# EAGLE schematic keytar-knob (EAGLE 9.5.0)
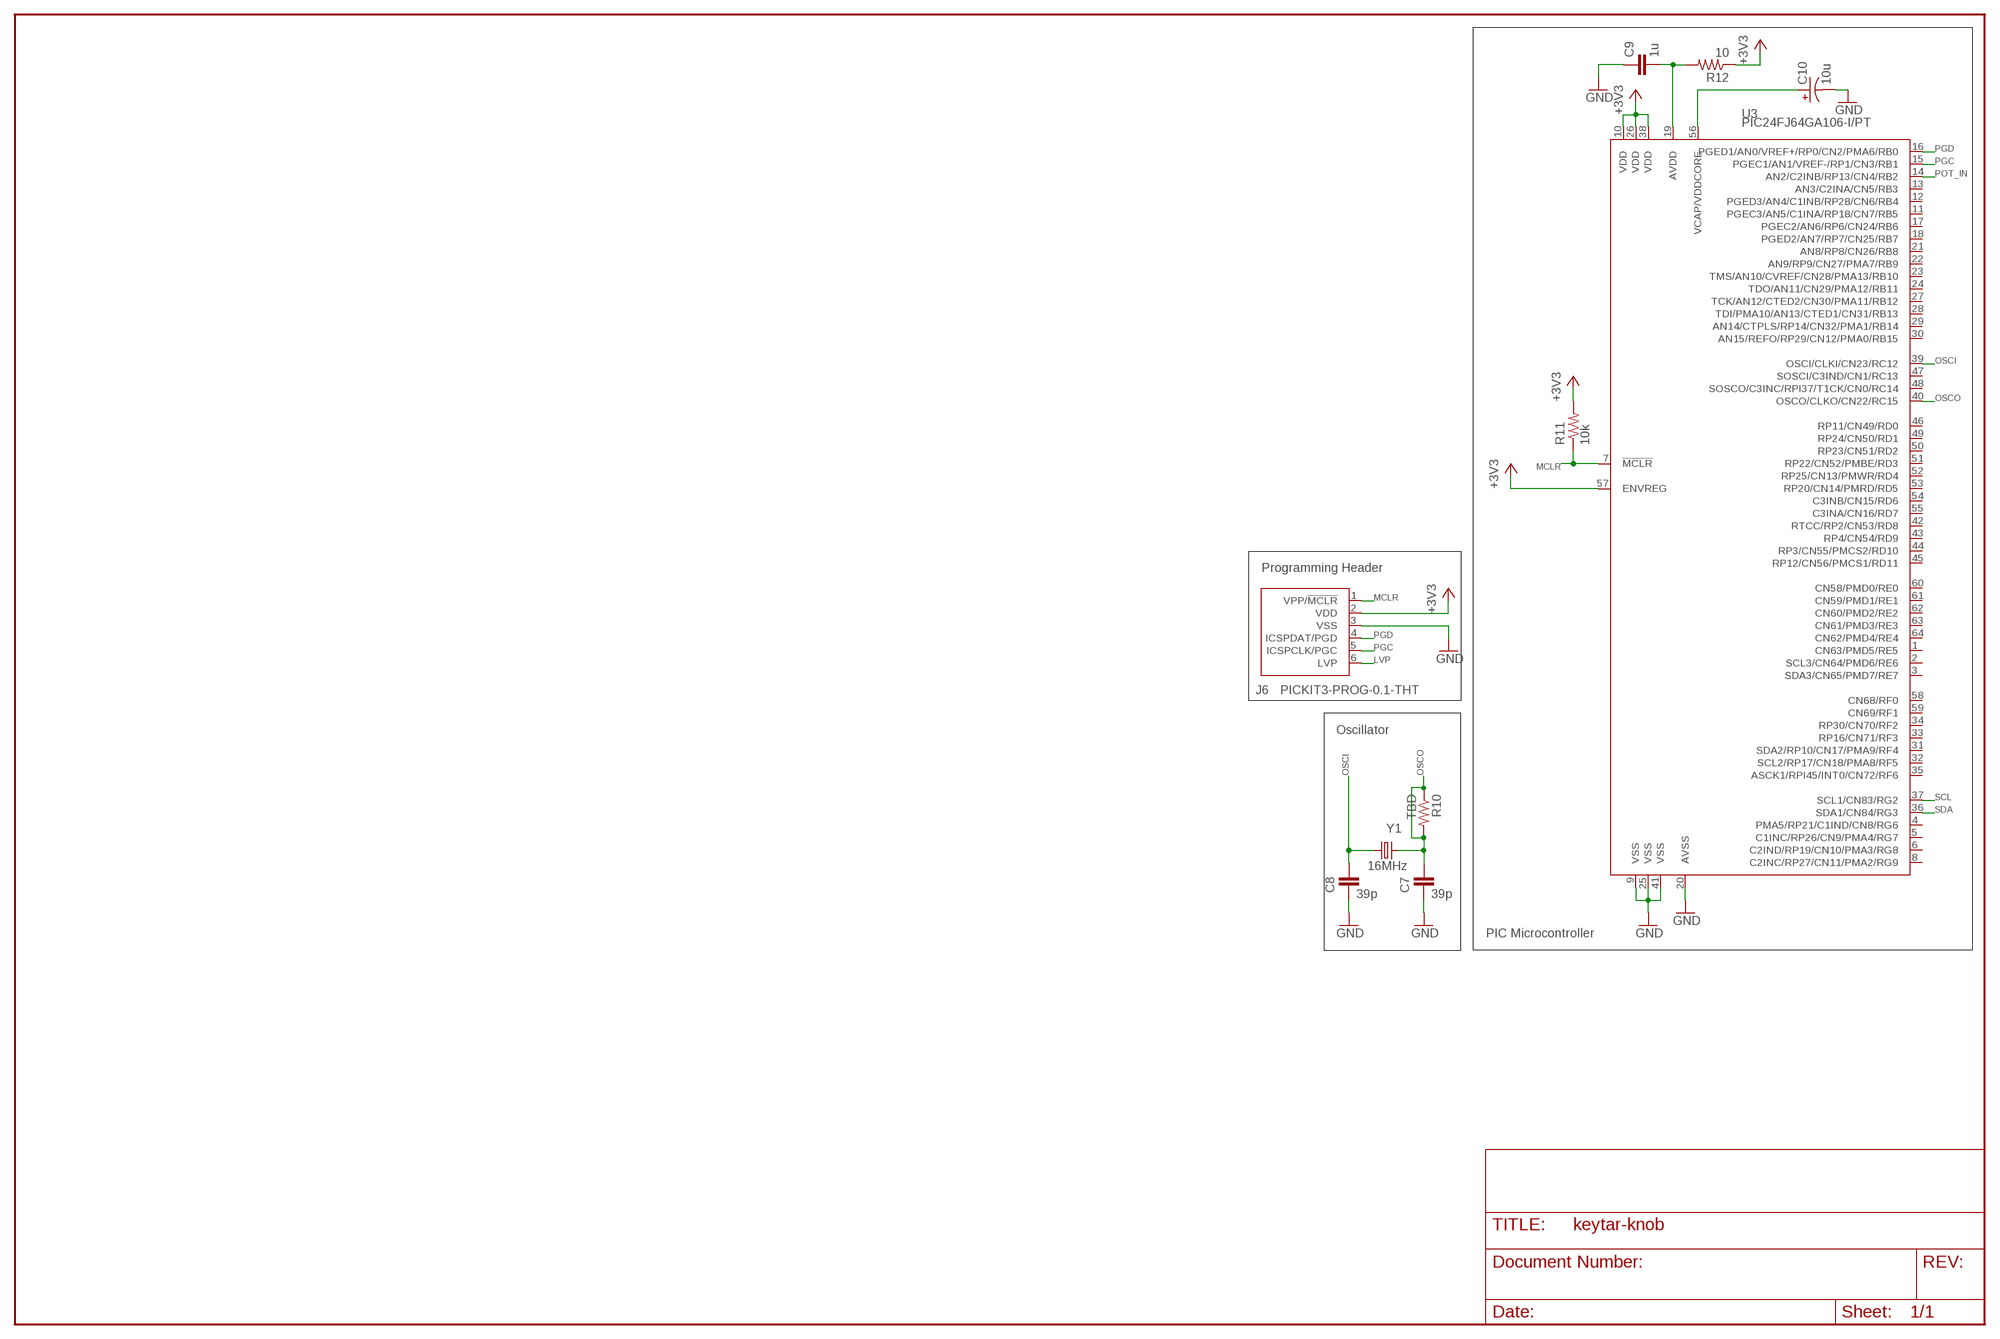
[diagram p0: schematic, sheet 1]

## Parts
C7  39p  C0603  [C0603]
C8  39p  C0603  [C0603]
C9  1u  C0603  [C0603]
C10  10u  AVX-CAP-N  [AVX-CAP-N]
J6  PICKIT3-PROG-0.1-THT  [HEADER-0.1-6]
R10  TBD  R0603  [R0603]
R11  10k  R0603  [R0603]
R12  10  R0603  [R0603]
U3  PIC24FJ64GA106-I/PT  [QFP50P1200X1200X120-64N]
Y1  16MHz  CRYSTAL-SMD-4  [CRYSTAL-SMD-4]

## Nets
+3V3: J6.2(VDD) R11.2 R12.1 U3.10(VDD) U3.26(VDD) U3.38(VDD) U3.57(ENVREG)
GND: C7.2 C8.2 C9.1 C10.C J6.3(VSS) U3.9(VSS) U3.20(AVSS) U3.25(VSS) U3.41(VSS)
LVP: J6.6(LVP)
MCLR: J6.1(VPP/!MCLR) R11.1 U3.7(!MCLR)
N$23: C9.2 R12.2 U3.19(AVDD)
N$24: C10.A U3.56(VCAP/VDDCORE)
OSCI: C8.1 U3.39(OSCI/CLKI/CN23/RC12) Y1.1
OSCO: C7.1 R10.1 R10.2 U3.40(OSCO/CLKO/CN22/RC15) Y1.3
PGC: J6.5(ICSPCLK/PGC) U3.15(PGEC1/AN1/VREF-/RP1/CN3/RB1)
PGD: J6.4(ICSPDAT/PGD) U3.16(PGED1/AN0/VREF+/RP0/CN2/PMA6/RB0)
POT_IN: U3.14(AN2/C2INB/RP13/CN4/RB2)
SCL: U3.37(SCL1/CN83/RG2)
SDA: U3.36(SDA1/CN84/RG3)
Unconnected: U3.1(CN63/PMD5/RE5) U3.2(SCL3/CN64/PMD6/RE6) U3.3(SDA3/CN65/PMD7/RE7) U3.4(PMA5/RP21/C1IND/CN8/RG6) U3.5(C1INC/RP26/CN9/PMA4/RG7) U3.6(C2IND/RP19/CN10/PMA3/RG8) U3.8(C2INC/RP27/CN11/PMA2/RG9) U3.11(PGEC3/AN5/C1INA/RP18/CN7/RB5) U3.12(PGED3/AN4/C1INB/RP28/CN6/RB4) U3.13(AN3/C2INA/CN5/RB3) U3.17(PGEC2/AN6/RP6/CN24/RB6) U3.18(PGED2/AN7/RP7/CN25/RB7) U3.21(AN8/RP8/CN26/RB8) U3.22(AN9/RP9/CN27/PMA7/RB9) U3.23(TMS/AN10/CVREF/CN28/PMA13/RB10) U3.24(TDO/AN11/CN29/PMA12/RB11) U3.27(TCK/AN12/CTED2/CN30/PMA11/RB12) U3.28(TDI/PMA10/AN13/CTED1/CN31/RB13) U3.29(AN14/CTPLS/RP14/CN32/PMA1/RB14) U3.30(AN15/REFO/RP29/CN12/PMA0/RB15) U3.31(SDA2/RP10/CN17/PMA9/RF4) U3.32(SCL2/RP17/CN18/PMA8/RF5) U3.33(RP16/CN71/RF3) U3.34(RP30/CN70/RF2) U3.35(ASCK1/RPI45/INT0/CN72/RF6) U3.42(RTCC/RP2/CN53/RD8) U3.43(RP4/CN54/RD9) U3.44(RP3/CN55/PMCS2/RD10) U3.45(RP12/CN56/PMCS1/RD11) U3.46(RP11/CN49/RD0) U3.47(SOSCI/C3IND/CN1/RC13) U3.48(SOSCO/C3INC/RPI37/T1CK/CN0/RC14) U3.49(RP24/CN50/RD1) U3.50(RP23/CN51/RD2) U3.51(RP22/CN52/PMBE/RD3) U3.52(RP25/CN13/PMWR/RD4) U3.53(RP20/CN14/PMRD/RD5) U3.54(C3INB/CN15/RD6) U3.55(C3INA/CN16/RD7) U3.58(CN68/RF0) U3.59(CN69/RF1) U3.60(CN58/PMD0/RE0) U3.61(CN59/PMD1/RE1) U3.62(CN60/PMD2/RE2) U3.63(CN61/PMD3/RE3) U3.64(CN62/PMD4/RE4)

## Notes on the sheet
- Programming Header
- Oscillator
- PIC Microcontroller

## Library data of the parts
C7-C9 = rmrd-lc:C0603
C10 = rmrd-lc:AVX-CAP-N
J6 = rmrd-lc:PICKIT3-PROG-0.1-THT
R10-R12 = rmrd-lc:R0603
U3 = rmrd-lc:PIC24FJ64GA106-I/PT
Y1 = rmrd-lc:CRYSTAL-SMD-4